# Altium schematic sheet optical-connection.SchDoc
size A; DrawnBy: Dylan Vogel, Lorna Lan; Revision: v1.1
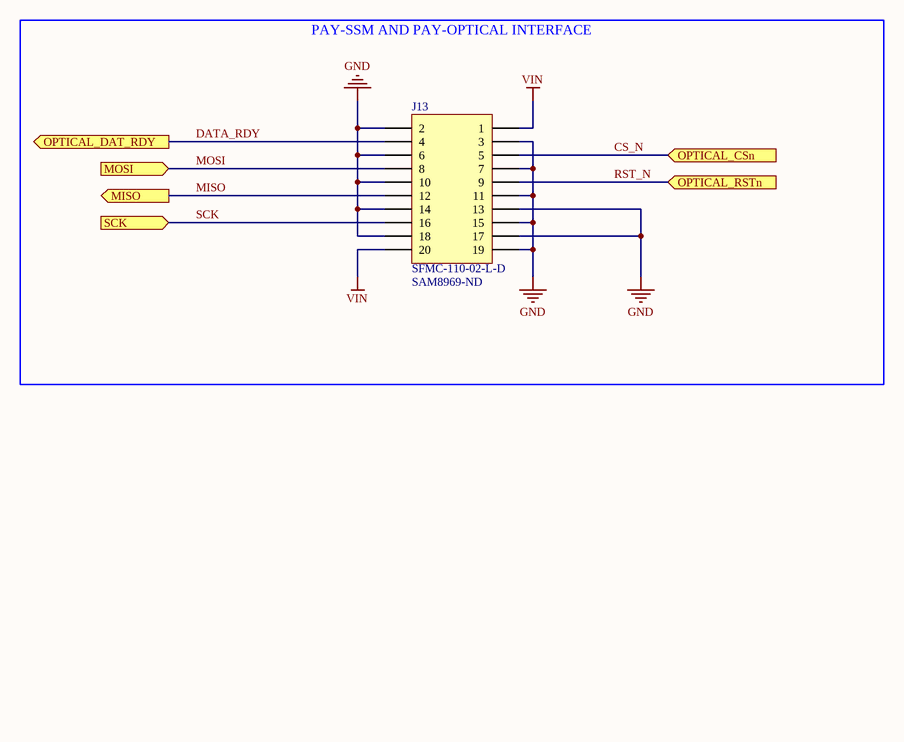
[diagram p0: optical-connection.SchDoc]

## Parts
J13  SFMC-110-02-L-D  Supplier Part Number 1: SAM8969-ND  [SFMC-110-02-L-D]

## Ports
MISO (out), MOSI (in), OPTICAL_CSn (in), OPTICAL_DAT_RDY (out), OPTICAL_RSTn (in), SCK (in)

## Nets
GND: J13.2 J13.3 J13.6 J13.7 J13.10 J13.11 J13.13 J13.14 J13.15 J13.17 J13.18 J13.19
VIN: J13.1 J13.20
CS_N: J13.5 ; port OPTICAL_CSn
DATA_RDY: J13.4 ; port OPTICAL_DAT_RDY
MISO: J13.12 ; port MISO
MOSI: J13.8 ; port MOSI
RST_N: J13.9 ; port OPTICAL_RSTn
SCK: J13.16 ; port SCK

## Notes on the sheet
- (near J13) PAY-SSM AND PAY-OPTICAL INTERFACE

## Library data of the parts
J13 = SFMC-110-02-L-D: Supplier 1: Digi-Key